# EAGLE design ai_firefly_prog (EAGLE 6.5.0)
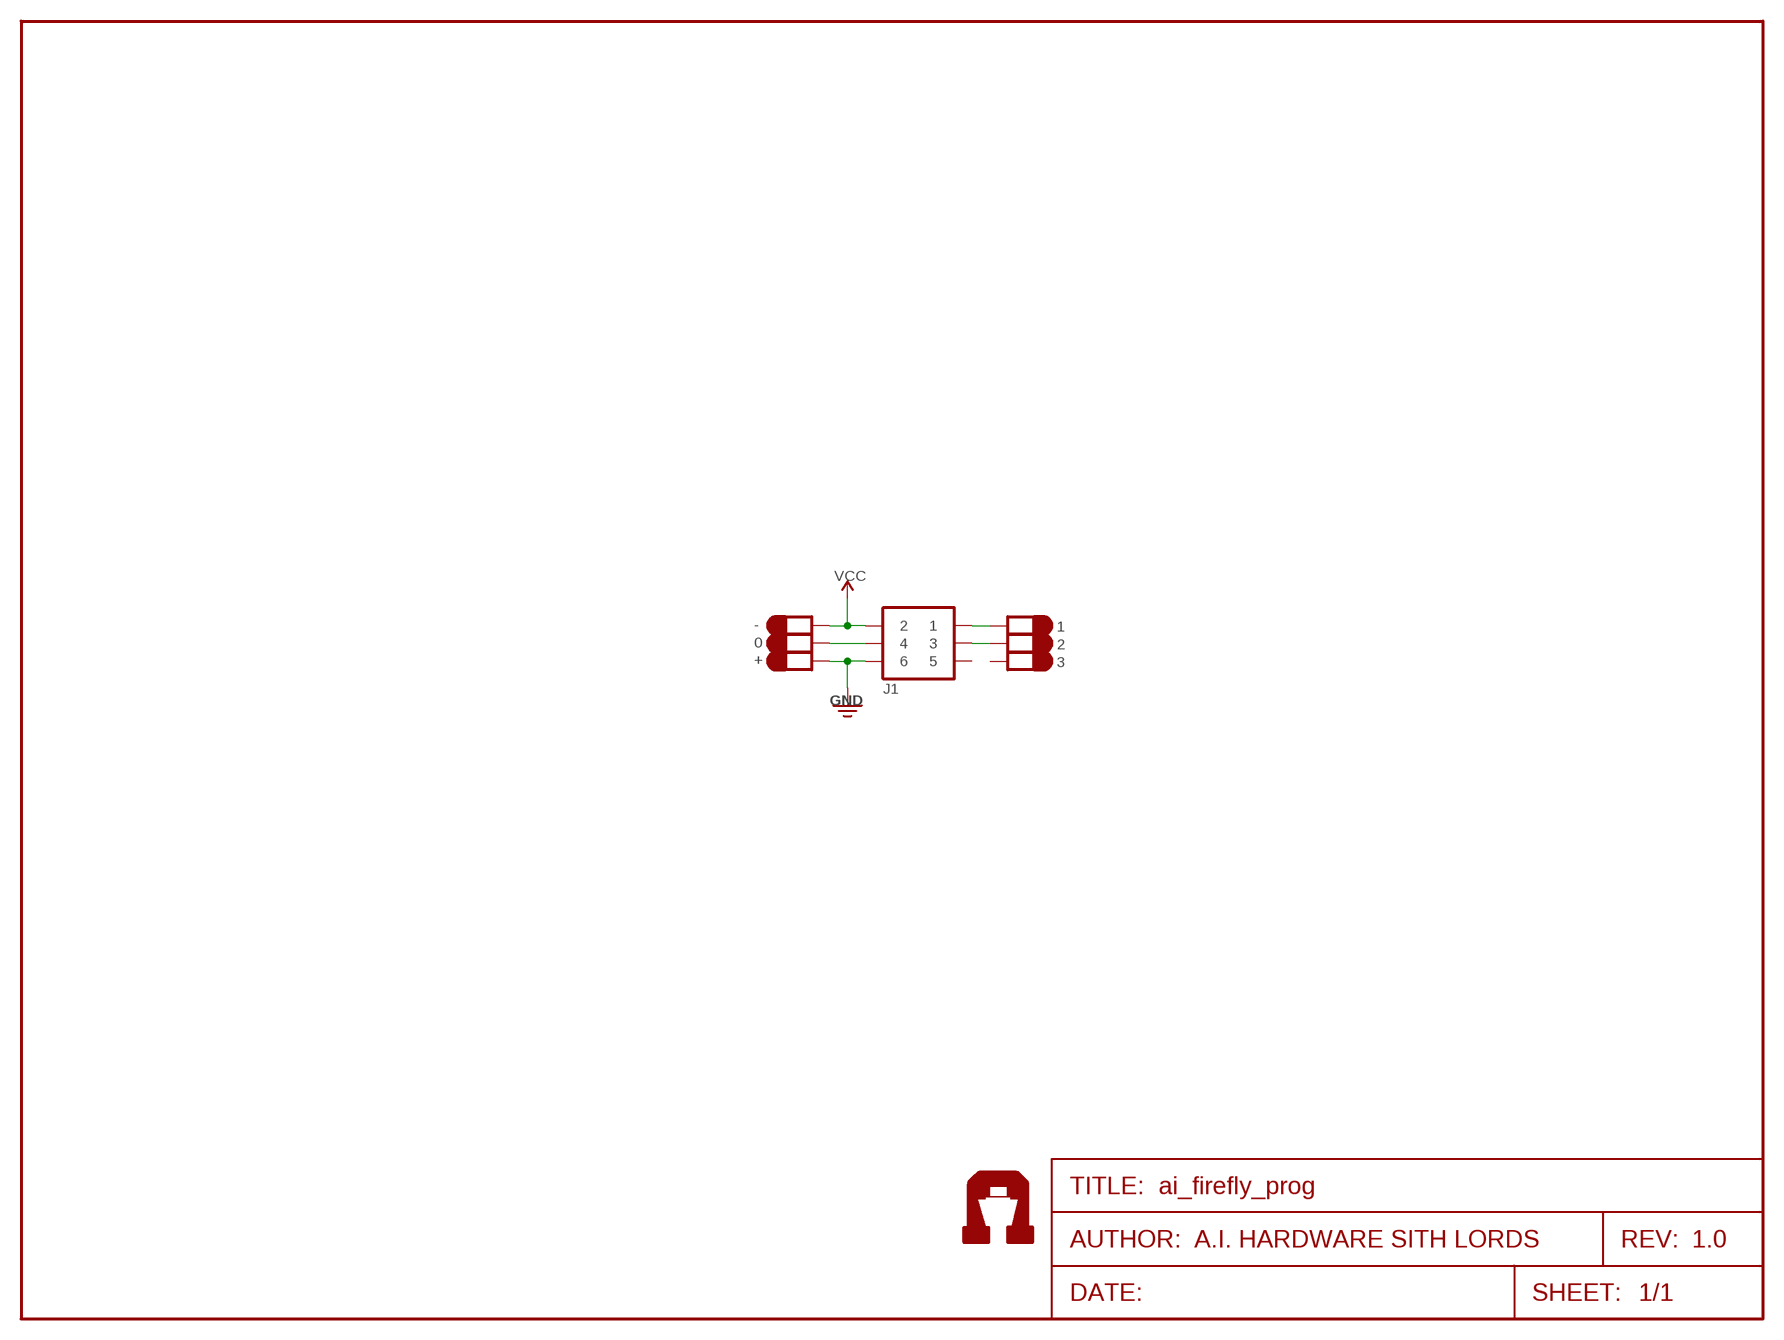
[diagram p0: schematic, sheet 1]
FRAME1 (FRAME-LETTER): AUTHOR: A.I. HARDWARE SITH LORDS; REV: 1.0

## Parts
0  1X01-PETAL  [1X01-PETAL]
1  1X01-PETAL  [1X01-PETAL]
2  1X01-PETAL  [1X01-PETAL]
3  1X01-PETAL  [1X01-PETAL]
+  1X01-PETAL  [1X01-PETAL]
-  1X01-PETAL  [1X01-PETAL]
J1  2X03  [2X03]
U$9  AI-LOGOXS  [AI-LOGO-XS]

## Nets
0: 0.1 J1.4
1: 1.1 J1.1
2: 2.1 J1.3
GND: +.1 J1.6
VCC: -.1 J1.2
Unconnected: 3.1 J1.5

## Library data of the parts
0 1-3 + - = Ai_Connectors:1X01-PETAL
J1 = Ai_Connectors:2X03
U$9 = Ai_Miscellany:AI-LOGO

## Net classes
0 default: width 0.254 mm
1 PWR: width 0.305 mm

## Board
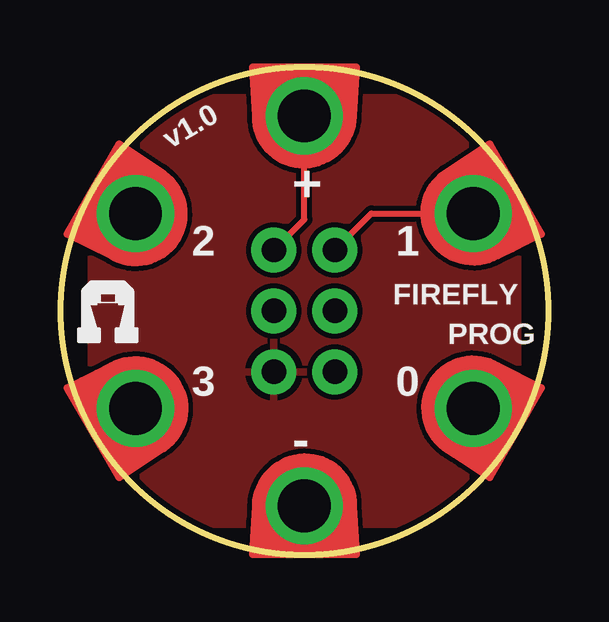
[diagram p1: board, top side]
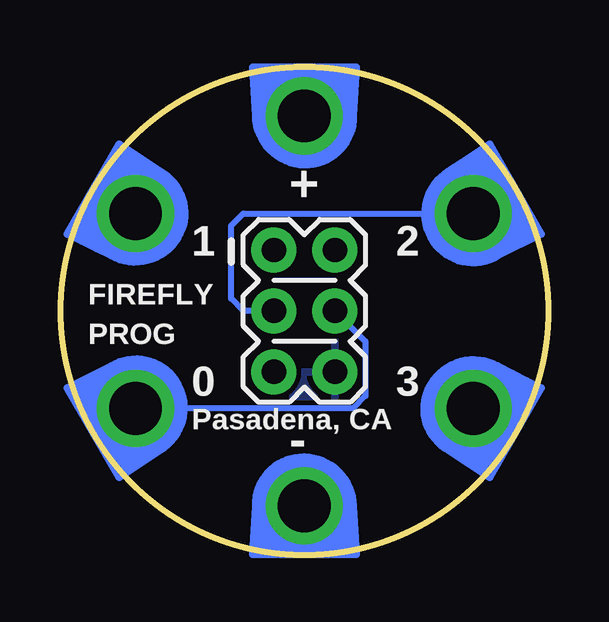
[diagram p2: board, bottom side, seen from below]

Size 20.32 x 20.32 mm. Coordinates in mm from the lower left corner, seen from the top.
Outline: circle at 10.16,10.16 radius 10.16
Copper layers (1*16): Top 0.035mm / dielectric 1.5mm / Bottom 0.035mm
Design rules "ai_2layer_qfn": minimum track width 7mil, minimum drill 15mil, track to track 8mil, track to pad 8mil, pad to pad 8mil, via to via 8mil, smd to smd 8mil, copper to edge 8mil, drill to drill 8mil, minimum pad ring 1mil, minimum via ring 10mil, stop-mask expansion 4mil, vias tented up to drill 20mil, thermal gap 10mil

### Footprints (pad centres in the part's own frame; a part is rotated, then mirrored left to right if it is on the bottom)
1X01-PETAL = drill 2.2: 1 0,0
2X03 = drill 1.016 pad 1.88: 1 -2.54,-1.27; 2 -2.54,1.27; 3 0,-1.27; 4 0,1.27; 5 2.54,-1.27; 6 2.54,1.27

### Placement (x,y rotation side)
0  17.2,6.1 240 top
1  17.2,14.22 300 top
2  3.12,14.22 60 top
3  3.12,6.1 120 top
+  10.16,2.03 180 top
-  10.16,18.29 0 top
J1  10.16,10.16 270 bottom
U$9  0.64,8.76 0 top

### Tracks (layer width: path | path; a pad name or v marks a point on that pad's centre or on a via)
0
  Bottom 0.254: J1.4 7.62,8.89 7.62,6.6 8.13,6.1 0.1
1
  Top 0.254: J1.1 12.95,14.22 1.1
2
  Bottom 0.254: J1.3 12.7,10.16 13.21,10.67 13.21,13.72 12.7,14.22 2.1
GND
  pour Bottom: 1.27,1.27 19.05,1.27 19.05,19.05 1.27,19.05
  pour Top: 1.27,19.05 1.27,1.27 19.05,1.27 19.05,19.05
VCC
  Top 0.254: J1.2 10.16,13.97 -.1

### Text on the board
tPlace: v1.0 | + | 2 | 1 | FIREFLY | PROG | 3 | 0 | -
bPlace: + | 2 | 1 | FIREFLY | PROG | 3 | 0 | Pasadena, CA | -